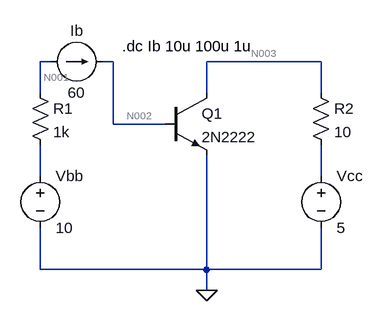
[diagram p0: schematic Q1.asc]
Q1.asc, the LTspice schematic file:
Version 4
SHEET 1 880 680
WIRE 144 -32 128 -32
WIRE 240 -32 224 -32
WIRE 560 -32 384 -32
WIRE 128 16 128 -32
WIRE 384 16 384 -32
WIRE 560 16 560 -32
WIRE 240 64 240 -32
WIRE 320 64 240 64
WIRE 128 144 128 96
WIRE 560 144 560 96
WIRE 128 288 128 224
WIRE 384 288 384 112
WIRE 384 288 128 288
WIRE 560 288 560 224
WIRE 560 288 384 288
WIRE 384 320 384 288
FLAG 384 320 0
SYMBOL voltage 128 128 R0
WINDOW 123 0 0 Left 0
WINDOW 39 0 0 Left 0
SYMATTR InstName Vbb
SYMATTR Value 10
SYMBOL voltage 560 128 R0
WINDOW 123 0 0 Left 0
WINDOW 39 0 0 Left 0
SYMATTR InstName Vcc
SYMATTR Value 5
SYMBOL npn 320 16 R0
SYMATTR InstName Q1
SYMATTR Value 2N2222
SYMBOL res 112 0 R0
SYMATTR InstName R1
SYMATTR Value 1k
SYMBOL current 144 -32 R270
WINDOW 0 32 40 VTop 2
WINDOW 3 -32 40 VBottom 2
SYMATTR InstName Ib
SYMATTR Value 60
SYMBOL res 544 0 R0
SYMATTR InstName R2
SYMATTR Value 10
TEXT 254 -56 Left 2 !.dc Ib 10u 100u 1u

The netlist it stands for:
* Q1.asc
Vbb N004 0 10
Vcc N005 0 5
Q1 N003 N002 0 0 2N2222
R1 N001 N004 1k
Ib N001 N002 60
R2 N003 N005 10
.model NPN NPN
.model PNP PNP
.lib standard.bjt
.dc Ib 10u 100u 1u
.backanno
.end

* Results of the author's LTspice run, read from the files saved beside the schematic
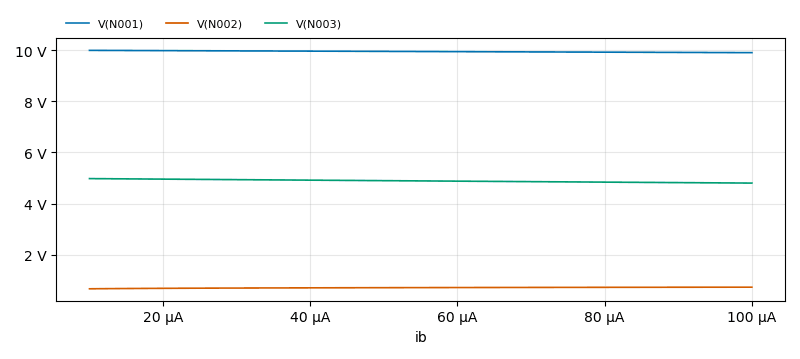
[diagram p1: DC transfer characteristic of Q1.asc, plotted from the saved traces]
* DC transfer characteristic, 1 run:
*   V(N001): 9.99 V at ib=10 µA, 9.9 V at ib=100 µA, min 9.9 V, max 9.99 V
*   V(N002): 673.6 mV at ib=10 µA, 737.5 mV at ib=100 µA, min 673.6 mV, max 737.5 mV
*   V(N003): 4.979 V at ib=10 µA, 4.804 V at ib=100 µA, min 4.804 V, max 4.979 V